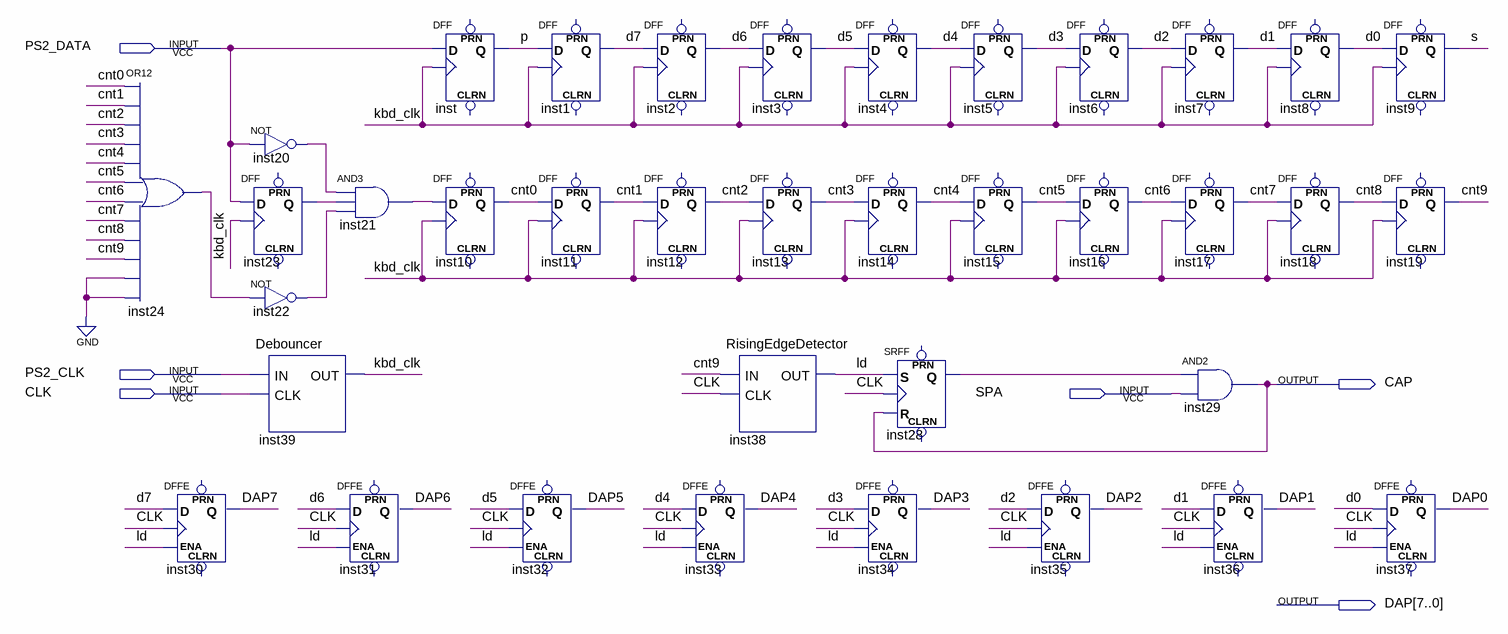
[diagram p0: schematic sheet]
// Quartus schematic UA.bdf as structural Verilog: 37 symbols, 6 pins
module UA (
  input  PS2_DATA,
  input  PS2_CLK,
  input  CLK,
  input  SPA,
  output CAP,
  output [7:0] DAP
);

  wire cnt0, cnt1, cnt2, cnt3, cnt4, cnt5, cnt6, cnt7, cnt8, cnt9, d0, d1, d2, d3, d4, d5, d6, d7,
       inst20_out, inst21_out, inst22_out, inst23_q, inst24_out, inst28_q, kbd_clk, ld, p, s;

  or inst24 (inst24_out, cnt0, cnt1, cnt2, cnt3, cnt4, cnt5, cnt6, cnt7, cnt8, cnt9, 1'b0, 1'b0);
  DFFE inst30 (.D(d7), .CLK(CLK), .ENA(ld), .Q(DAP[7]));  // open: PRN, CLRN
  not inst20 (inst20_out, PS2_DATA);
  DFF inst23 (.CLK(kbd_clk), .D(PS2_DATA), .Q(inst23_q));  // open: CLRN, PRN
  not inst22 (inst22_out, inst24_out);
  Debouncer inst39 (.IN(PS2_CLK), .CLK(CLK), .OUT(kbd_clk));
  and inst21 (inst21_out, inst20_out, inst23_q, inst22_out);
  DFFE inst31 (.D(d6), .CLK(CLK), .ENA(ld), .Q(DAP[6]));  // open: PRN, CLRN
  DFF inst (.CLK(kbd_clk), .D(PS2_DATA), .Q(p));  // open: CLRN, PRN
  DFF inst10 (.CLK(kbd_clk), .D(inst21_out), .Q(cnt0));  // open: CLRN, PRN
  DFF inst1 (.CLK(kbd_clk), .D(p), .Q(d7));  // open: CLRN, PRN
  DFF inst11 (.CLK(kbd_clk), .D(cnt0), .Q(cnt1));  // open: CLRN, PRN
  DFFE inst32 (.D(d5), .CLK(CLK), .ENA(ld), .Q(DAP[5]));  // open: PRN, CLRN
  DFF inst2 (.CLK(kbd_clk), .D(d7), .Q(d6));  // open: CLRN, PRN
  DFF inst12 (.CLK(kbd_clk), .D(cnt1), .Q(cnt2));  // open: CLRN, PRN
  RisingEdgeDetector inst38 (.IN(cnt9), .CLK(CLK), .OUT(ld));
  DFFE inst33 (.D(d4), .CLK(CLK), .ENA(ld), .Q(DAP[4]));  // open: PRN, CLRN
  DFF inst3 (.CLK(kbd_clk), .D(d6), .Q(d5));  // open: CLRN, PRN
  DFF inst13 (.CLK(kbd_clk), .D(cnt2), .Q(cnt3));  // open: CLRN, PRN
  DFF inst4 (.CLK(kbd_clk), .D(d5), .Q(d4));  // open: CLRN, PRN
  DFF inst14 (.CLK(kbd_clk), .D(cnt3), .Q(cnt4));  // open: CLRN, PRN
  DFFE inst34 (.D(d3), .CLK(CLK), .ENA(ld), .Q(DAP[3]));  // open: PRN, CLRN
  SRFF inst28 (.S(ld), .R(CAP), .CLK(CLK), .Q(inst28_q));  // open: PRN, CLRN
  DFF inst5 (.CLK(kbd_clk), .D(d4), .Q(d3));  // open: CLRN, PRN
  DFF inst15 (.CLK(kbd_clk), .D(cnt4), .Q(cnt5));  // open: CLRN, PRN
  DFFE inst35 (.D(d2), .CLK(CLK), .ENA(ld), .Q(DAP[2]));  // open: PRN, CLRN
  DFF inst6 (.CLK(kbd_clk), .D(d3), .Q(d2));  // open: CLRN, PRN
  DFF inst16 (.CLK(kbd_clk), .D(cnt5), .Q(cnt6));  // open: CLRN, PRN
  DFF inst7 (.CLK(kbd_clk), .D(d2), .Q(d1));  // open: CLRN, PRN
  DFF inst17 (.CLK(kbd_clk), .D(cnt6), .Q(cnt7));  // open: CLRN, PRN
  and inst29 (CAP, inst28_q, SPA);
  DFFE inst36 (.D(d1), .CLK(CLK), .ENA(ld), .Q(DAP[1]));  // open: PRN, CLRN
  DFF inst8 (.CLK(kbd_clk), .D(d1), .Q(d0));  // open: CLRN, PRN
  DFF inst18 (.CLK(kbd_clk), .D(cnt7), .Q(cnt8));  // open: CLRN, PRN
  DFF inst9 (.CLK(kbd_clk), .D(d0), .Q(s));  // open: CLRN, PRN
  DFF inst19 (.CLK(kbd_clk), .D(cnt8), .Q(cnt9));  // open: CLRN, PRN
  DFFE inst37 (.D(d0), .CLK(CLK), .ENA(ld), .Q(DAP[0]));  // open: PRN, CLRN
endmodule
